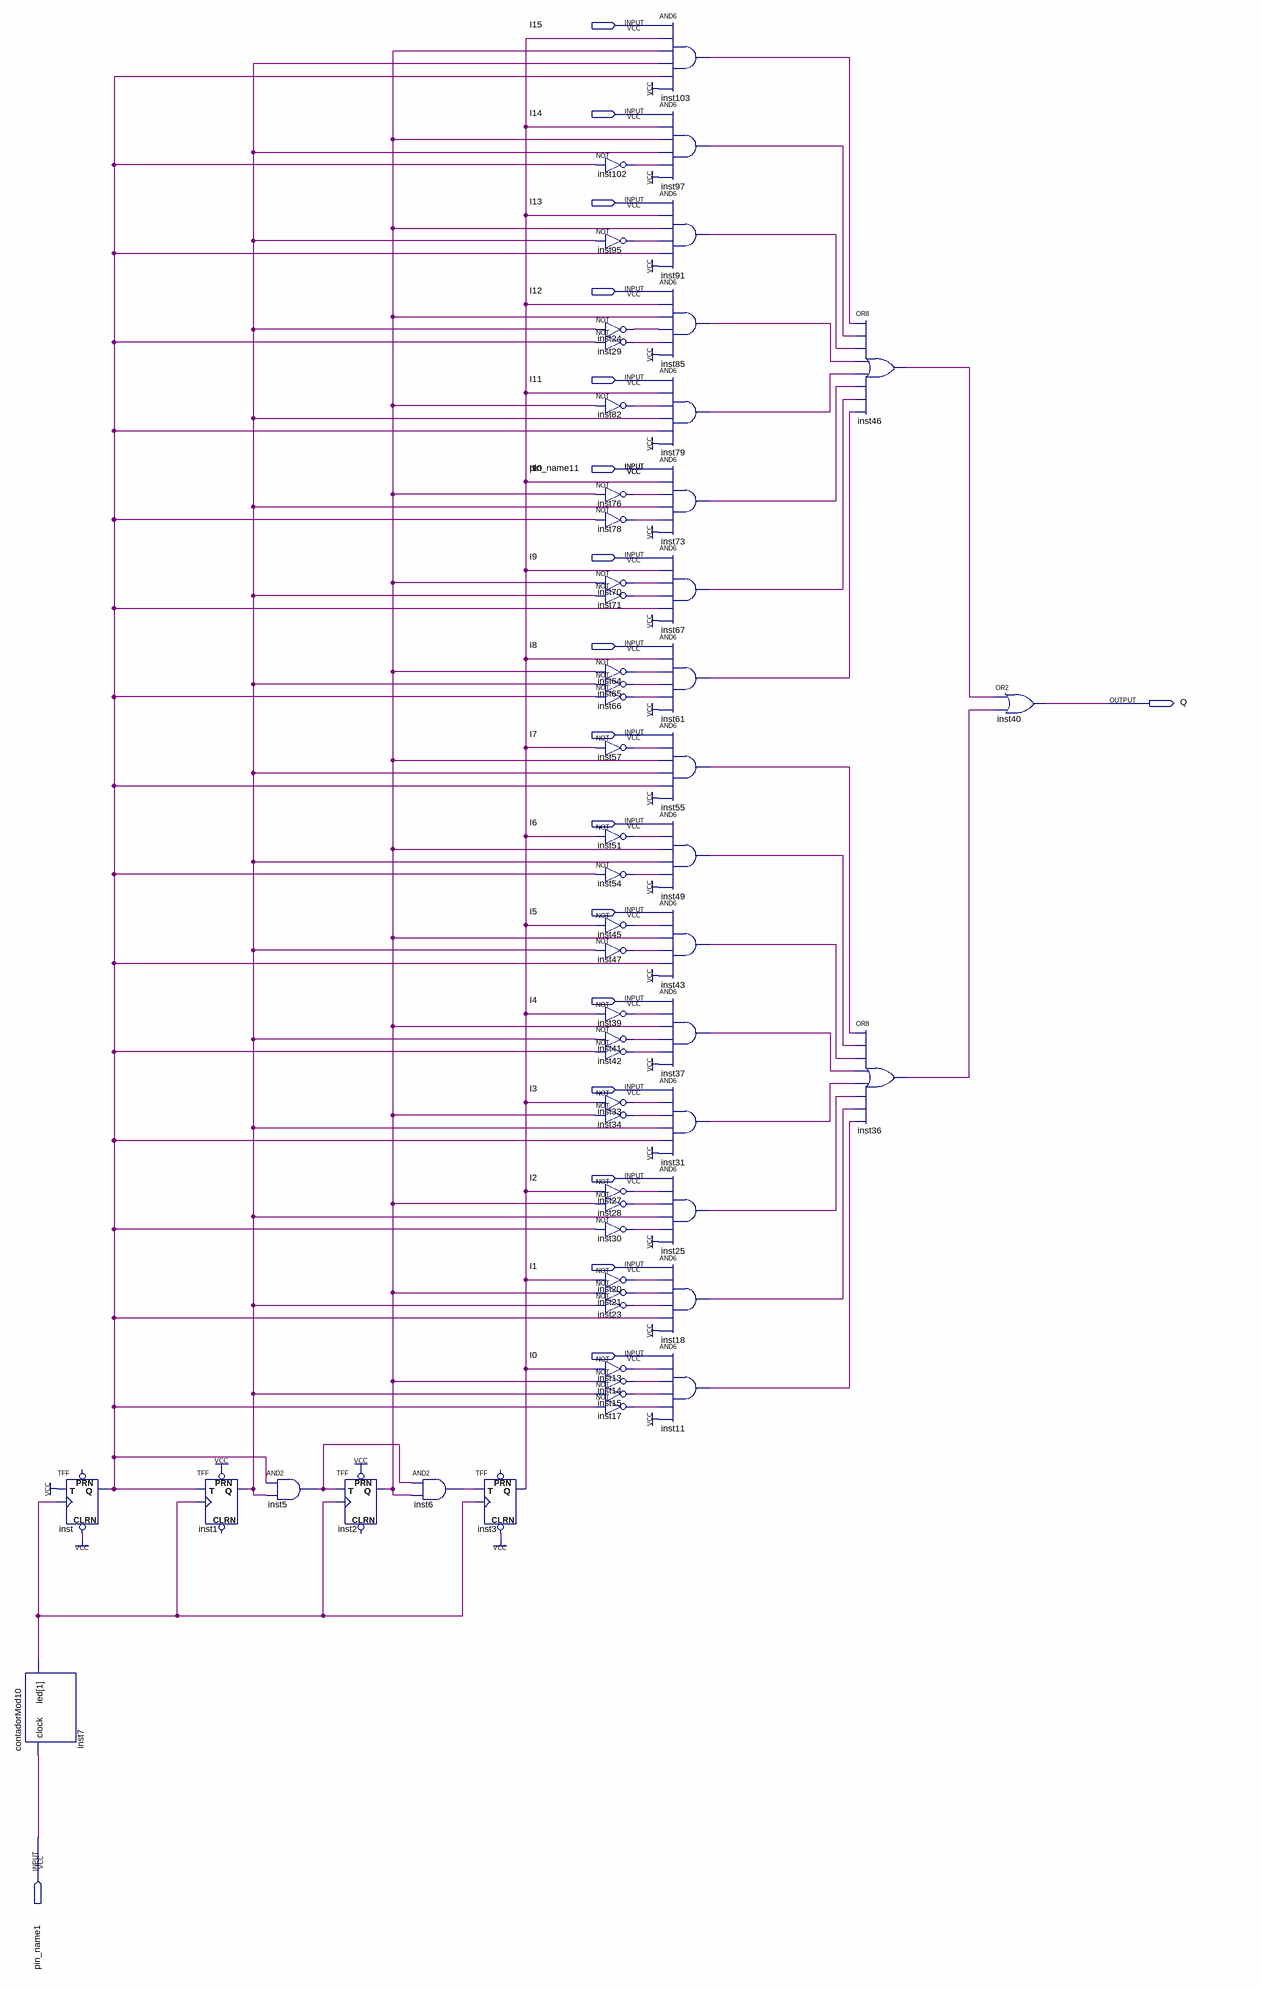
[diagram p0: schematic sheet]
// Quartus schematic Mux_16.bdf as structural Verilog: 58 symbols, 20 pins
module Mux_16 (
  input  I15,
  input  I14,
  input  I13,
  input  I12,
  input  I11,
  input  pin_name11,
  input  I9,
  input  I10,
  input  I8,
  input  I7,
  input  I6,
  input  I5,
  input  I4,
  input  I3,
  input  I2,
  input  I1,
  input  I0,
  input  pin_name1,
  output Q
);

  wire inst1_q, inst2_q, inst3_q, inst5_out, inst6_out, inst7_led, inst11_out, inst13_out, inst14_out,
       inst15_out, inst17_out, inst18_out, inst20_out, inst21_out, inst23_out, inst24_out, inst25_out,
       inst27_out, inst28_out, inst29_out, inst30_out, inst31_out, inst33_out, inst34_out, inst36_out,
       inst37_out, inst39_out, inst41_out, inst42_out, inst43_out, inst45_out, inst46_out, inst47_out,
       inst49_out, inst51_out, inst54_out, inst55_out, inst57_out, inst61_out, inst64_out, inst65_out,
       inst66_out, inst67_out, inst70_out, inst71_out, inst73_out, inst76_out, inst78_out, inst79_out,
       inst82_out, inst85_out, inst91_out, inst95_out, inst97_out, inst102_out, inst103_out, inst_q;

  contadorMod10 inst7 (.clock(pin_name1), .led(inst7_led));
  TFF inst (.CLRN(1'b1), .T(1'b1), .CLK(inst7_led), .Q(inst_q));  // open: PRN
  TFF inst1 (.PRN(1'b1), .T(inst_q), .CLK(inst7_led), .Q(inst1_q));  // open: CLRN
  and inst5 (inst5_out, inst_q, inst1_q);
  TFF inst2 (.PRN(1'b1), .T(inst5_out), .CLK(inst7_led), .Q(inst2_q));  // open: CLRN
  and inst6 (inst6_out, inst5_out, inst2_q);
  TFF inst3 (.CLRN(1'b1), .T(inst6_out), .CLK(inst7_led), .Q(inst3_q));  // open: PRN
  not inst102 (inst102_out, inst_q);
  not inst95 (inst95_out, inst1_q);
  not inst24 (inst24_out, inst1_q);
  not inst29 (inst29_out, inst_q);
  not inst82 (inst82_out, inst2_q);
  not inst76 (inst76_out, inst2_q);
  not inst78 (inst78_out, inst_q);
  not inst70 (inst70_out, inst2_q);
  not inst71 (inst71_out, inst1_q);
  not inst64 (inst64_out, inst2_q);
  not inst65 (inst65_out, inst1_q);
  not inst66 (inst66_out, inst_q);
  not inst57 (inst57_out, inst3_q);
  not inst51 (inst51_out, inst3_q);
  not inst54 (inst54_out, inst_q);
  not inst45 (inst45_out, inst3_q);
  not inst47 (inst47_out, inst1_q);
  not inst39 (inst39_out, inst3_q);
  not inst41 (inst41_out, inst1_q);
  not inst42 (inst42_out, inst_q);
  not inst33 (inst33_out, inst3_q);
  not inst34 (inst34_out, inst2_q);
  not inst27 (inst27_out, inst3_q);
  not inst28 (inst28_out, inst2_q);
  not inst30 (inst30_out, inst_q);
  not inst20 (inst20_out, inst3_q);
  not inst21 (inst21_out, inst2_q);
  not inst23 (inst23_out, inst1_q);
  not inst13 (inst13_out, inst3_q);
  not inst14 (inst14_out, inst2_q);
  not inst15 (inst15_out, inst1_q);
  not inst17 (inst17_out, inst_q);
  and inst103 (inst103_out, I15, inst3_q, inst2_q, inst1_q, inst_q, 1'b1);
  and inst97 (inst97_out, I14, inst3_q, inst2_q, inst1_q, inst102_out, 1'b1);
  and inst91 (inst91_out, I13, inst3_q, inst2_q, inst95_out, inst_q, 1'b1);
  and inst85 (inst85_out, I12, inst3_q, inst2_q, inst24_out, inst29_out, 1'b1);
  and inst79 (inst79_out, I11, inst3_q, inst82_out, inst1_q, inst_q, 1'b1);
  and inst73 (inst73_out, I9, inst3_q, inst76_out, inst1_q, inst78_out, 1'b1);
  and inst67 (inst67_out, I9, inst3_q, inst70_out, inst71_out, inst_q, 1'b1);
  and inst61 (inst61_out, I8, inst3_q, inst64_out, inst65_out, inst66_out, 1'b1);
  and inst55 (inst55_out, I7, inst57_out, inst2_q, inst1_q, inst_q, 1'b1);
  and inst49 (inst49_out, I6, inst51_out, inst2_q, inst1_q, inst54_out, 1'b1);
  and inst43 (inst43_out, I5, inst45_out, inst2_q, inst47_out, inst_q, 1'b1);
  and inst37 (inst37_out, I4, inst39_out, inst2_q, inst41_out, inst42_out, 1'b1);
  and inst31 (inst31_out, I3, inst33_out, inst34_out, inst1_q, inst_q, 1'b1);
  and inst25 (inst25_out, I2, inst27_out, inst28_out, inst1_q, inst30_out, 1'b1);
  and inst18 (inst18_out, I1, inst20_out, inst21_out, inst23_out, inst_q, 1'b1);
  and inst11 (inst11_out, I0, inst13_out, inst14_out, inst15_out, inst17_out, 1'b1);
  or inst46 (inst46_out, inst103_out, inst97_out, inst91_out, inst85_out, inst79_out, inst73_out, inst67_out, inst61_out);
  or inst36 (inst36_out, inst55_out, inst49_out, inst43_out, inst37_out, inst31_out, inst25_out, inst18_out, inst11_out);
  or inst40 (Q, inst46_out, inst36_out);

  assign I10 = I9;
  assign pin_name11 = I9;
endmodule
